# EAGLE design TessCam (EAGLE 5.06)
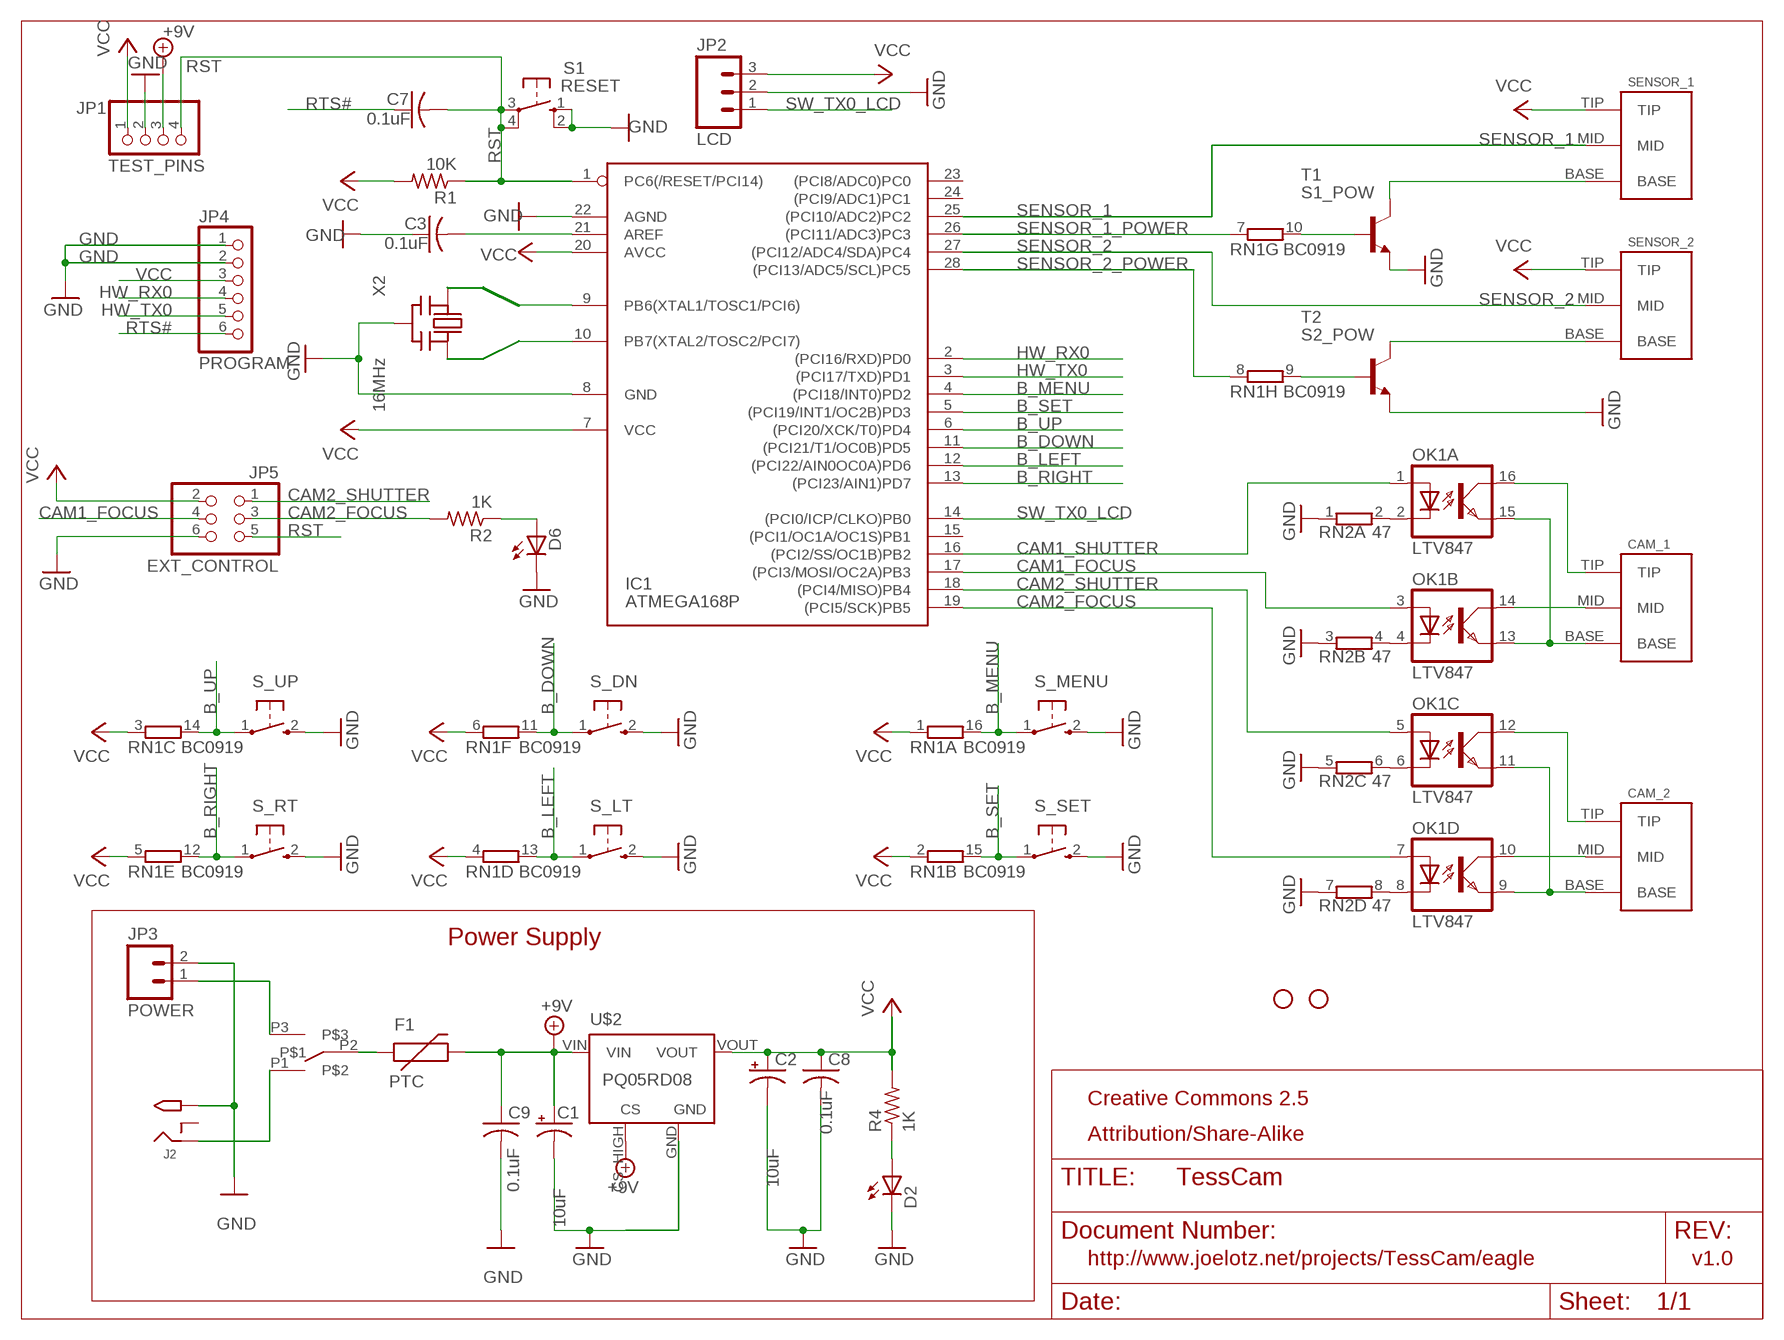
[diagram p0: schematic, sheet 1]

## Parts
C1  10uF  CPOL-USE2.5-6  [E2,5-6]
C2  10uF  CPOL-USE2.5-6  [E2,5-6]
C3  0.1uF  C-US025-025X050  [C025-025X050]
C7  0.1uF  C-US025-025X050  [C025-025X050]
C8  0.1uF  C-US025-025X050  [C025-025X050]
C9  0.1uF  C-US025-025X050  [C025-025X050]
CAM_1  3.5MM_JACK_ASJ-1-3STANDARD  [3.5MM_JACK_ASJ-1-3]
CAM_2  3.5MM_JACK_ASJ-1-3STANDARD  [3.5MM_JACK_ASJ-1-3]
D2  LTL-1CHG  LED3MM  [LED3MM]
D6  LTL-1CHE  LED3MM  [LED3MM]
F1  PTC  PTCPTH  [PTC]
IC1  ATMEGA168P  ATMEGA168PROUND  [DIL28/3]
J2  2.1MMJACK  [PJ-102A]
JP1  TEST_PINS  PINHD-1X4CB  [1X04-CB]
JP2  LCD  M03SCREW_LOCK  [SCREWTERMINAL-3.5MM-3_LOCK.007S]
JP3  POWER  M023.5MM_LOCK  [SCREWTERMINAL-3.5MM-2_LOCK]
JP4  PROGRAM  PINHD-1X6CLEAN  [1X06-CLEAN]
JP5  EXT_CONTROL  PINHD-2X3  [2X03]
OK1  LTV847  PC847  [DIL16]
R1  10K  R-US_0207/10  [0207/10]
R2  1K  R-US_0207/10  [0207/10]
R4  1K  R-US_0207/10  [0207/10]
RN1  BC0919  8R-N  [DIL16]
RN2  47  E4R  [SIL8]
S1  RESET  10-XX  [B3F-10XX]
S_DN  SWITCH_PUSH  [PUSH_SWITCH]
S_LT  SWITCH_PUSH  [PUSH_SWITCH]
S_MENU  SWITCH_PUSH  [PUSH_SWITCH]
S_RT  SWITCH_PUSH  [PUSH_SWITCH]
S_SET  SWITCH_PUSH  [PUSH_SWITCH]
S_UP  SWITCH_PUSH  [PUSH_SWITCH]
SENSOR_1  3.5MM_JACK_ASJ-1-3STANDARD  [3.5MM_JACK_ASJ-1-3]
SENSOR_2  3.5MM_JACK_ASJ-1-3STANDARD  [3.5MM_JACK_ASJ-1-3]
T1  S1_POW  BC338-25-NPN-TO92-EBC  [TO92-EBC]
T2  S2_POW  BC338-25-NPN-TO92-EBC  [TO92-EBC]
U$1  P040020B  [P040020B]
U$2  PQ05RD08  [TO220-4]
U$7  STAND-OFF  [STAND-OFF]
U$8  STAND-OFF  [STAND-OFF]
X2  16MHz  CERMOSCILL  [CERM_OSC]

## Nets
+9V: C1.+ C9.1 F1.P$2 JP1.3 U$2.CS_HIGH(CS) U$2.VIN
B_DOWN: IC1.11((PCI21/T1/OC0B)PD5) RN1.11 S_DN.1(P)
B_LEFT: IC1.12((PCI22/AIN0OC0A)PD6) RN1.13 S_LT.1(P)
B_MENU: IC1.4((PCI18/INT0)PD2) RN1.16 S_MENU.1(P)
B_RIGHT: IC1.13((PCI23/AIN1)PD7) RN1.12 S_RT.1(P)
B_SET: IC1.5((PCI19/INT1/OC2B)PD3) RN1.15 S_SET.1(P)
B_UP: IC1.6((PCI20/XCK/T0)PD4) RN1.14 S_UP.1(P)
CAM1_FOCUS: IC1.17((PCI3/MOSI/OC2A)PB3) JP5.4 OK1.3(B:A)
CAM1_SHUTTER: IC1.16((PCI2/SS/OC1B)PB2) OK1.1(A:A)
CAM2_FOCUS: IC1.19((PCI5/SCK)PB5) JP5.3 OK1.7(D:A) R2.2
CAM2_SHUTTER: IC1.18((PCI4/MISO)PB4) JP5.1 OK1.5(C:A)
GND: C1.- C2.- C3.1 C8.2 C9.2 D2.K(C) D6.K(C) IC1.8(GND) IC1.22(AGND) J2.TIP JP1.2 JP2.2 JP3.2 JP4.1 JP4.2 JP5.6 RN2.1 RN2.3 RN2.5 RN2.7 S1.1(S) S1.2(S1) S_DN.2(S) S_LT.2(S) S_MENU.2(S) S_RT.2(S) S_SET.2(S) S_UP.2(S) T1.E T2.E U$2.GND X2.P$2(GND)
HW_RX0: IC1.2((PCI16/RXD)PD0) JP4.4
HW_TX0: IC1.3((PCI17/TXD)PD1) JP4.5
N$1: IC1.9(PB6(XTAL1/TOSC1/PCI6)) X2.P$1(IN)
N$2: IC1.10(PB7(XTAL2/TOSC2/PCI7)) X2.P$3(OUT)
N$3: C3.2 IC1.21(AREF)
N$4: RN1.10 T1.B
N$5: F1.P$1 U$1.P2
N$6: OK1.2(A:C) RN2.2
N$7: CAM_2.MID OK1.10(D:COL)
N$8: OK1.4(B:C) RN2.4
N$9: CAM_1.TIP OK1.16(A:COL)
N$10: RN1.9 T2.B
N$11: SENSOR_1.BASE T1.C
N$12: OK1.6(C:C) RN2.6
N$13: OK1.8(D:C) RN2.8
N$15: CAM_2.TIP OK1.12(C:COL)
N$16: CAM_2.BASE OK1.9(D:EMIT) OK1.11(C:EMIT)
N$17: CAM_1.MID OK1.14(B:COL)
N$18: CAM_1.BASE OK1.13(B:EMIT) OK1.15(A:EMIT)
N$19: JP3.1 U$1.P3
N$23: J2.RING U$1.P1
N$26: D2.A R4.1
N$27: D6.A R2.1
N$28: SENSOR_2.BASE T2.C
RST: C7.2 IC1.1(PC6(/RESET/PCI14)) JP1.4 JP5.5 R1.1 S1.3(P) S1.4(P1)
RTS#: C7.1 JP4.6
SENSOR_1: IC1.25((PCI10/ADC2)PC2) SENSOR_1.MID
SENSOR_1_POWER: IC1.26((PCI11/ADC3)PC3) RN1.7
SENSOR_2: IC1.27((PCI12/ADC4/SDA)PC4) SENSOR_2.MID
SENSOR_2_POWER: IC1.28((PCI13/ADC5/SCL)PC5) RN1.8
SW_TX0_LCD: IC1.14((PCI0/ICP/CLKO)PB0) JP2.1
VCC: C2.+ C8.1 IC1.7(VCC) IC1.20(AVCC) JP1.1 JP2.3 JP4.3 JP5.2 R1.2 R4.2 RN1.1 RN1.2 RN1.3 RN1.4 RN1.5 RN1.6 SENSOR_1.TIP SENSOR_2.TIP U$2.VOUT
Unconnected: IC1.15((PCI1/OC1A/OC1S)PB1) IC1.23((PCI8/ADC0)PC0) IC1.24((PCI9/ADC1)PC1) J2.RING_SW

## Notes on the sheet
- Power Supply
- Creative Commons 2.5
- Attribution/Share-Alike
- http://www.joelotz.net/projects/TessCam/eagle | v1.0

## Library data of the parts
C1 C2 = minimidi:CPOL-US: POLARIZED CAPACITOR, American symbol
C3 C7-C9 = minimidi:C-US: CAPACITOR, American symbol
CAM_1 CAM_2 SENSOR_1 SENSOR_2 = HobbyRobotics:3.5MM_JACK_ASJ-1-3
D2 D6 = minimidi:LED: LED OSRAM: - CHIPLED LG R971, LG N971, LY N971, LG Q971, LY Q971, LO R971, LY R971 LH N974, LH R974 LS Q976, LO Q976, LY Q976 LO Q996 - Hyper CHIPLED LW Q18S LB Q993, LB Q99A, LB R99A - SideLED LS A670, LO A670, LY A670, LG A670, LP A670 LB A673, LV A673, LT A673, LW A673 LH A674 LY A675 LS A676, LA A676, LO A676, LY A676, LW A676 LS A679, LY A679, LG A679 - Hyper Micro SIDELED® LS Y876, LA Y876, LO Y876, LY Y876 LT Y87S - SmartLED LW L88C, LW L88S LB L89C, LB L89S, LG L890 LS L89K, LO L89K, LY L89K LS L896, LA L896, LO L896, LY L896 - TOPLED LS T670, LO T670, LY T670, LG T670, LP T670 LSG T670, LSP T670, LSY T670, LOP T670, LYG T670 LG T671, LOG T671, LSG T671 LB T673, LV T673, LT T673, LW T673 LH T674 LS T676, LA T676, LO T676, LY T676, LB T676, LH T676, LSB T676, LW T676 LB T67C, LV T67C, LT T67C, LS T67K, LO T67K, LY T67K, LW E67C LS E67B, LA E67B, LO E67B, LY E67B, LB E67C, LV E67C, LT E67C LW T67C LS T679, LY T679, LG T679 LS T770, LO T770, LY T770, LG T770, LP T770 LB T773, LV T773, LT T773, LW T773 LH T774 LS E675, LA E675, LY E675, LS T675 LS T776, LA T776, LO T776, LY T776, LB T776 LHGB T686 LT T68C, LB T68C - Hyper Mini TOPLED® LB M676 - Mini TOPLED Santana® LG M470 LS M47K, LO M47K, LY M47K Source: http://www.osram.convergy.de/
F1 = SparkFun:PTC: Resettable Fuse PTC Resettable Fuse. Spark Fun Electronics SKU : COM-08357
IC1 = avr:ATMEGA168*P: MICROCONTROLLER 16 kBytes FLASH 1 kBytes SRAM 512 Bytes EEPROM USART 8-channel 10 bit ADC
J2 = minimidi:2.1MMJACK
JP1 = carduino:PINHD-1X4: PIN HEADER
JP2 = HobbyRobotics:M03: Header 3 Standard 3-pin 0.1" header. Use with straight break away headers (SKU : PRT-00116), right angle break away headers (PRT-00553), swiss pins (PRT-00743), machine pins (PRT-00117), and female headers (PRT-00115). Molex polarized connector foot print use with SKU : PRT-08232 with associated crimp pins and housings.
JP3 = SparkFun:M02: Header 2 Standard 2-pin 0.1" header. Use with straight break away headers (SKU : PRT-00116), right angle break away headers (PRT-00553), swiss pins (PRT-00743), machine pins (PRT-00117), and female headers (PRT-00115). Molex polarized connector foot print use with SKU : PRT-08233 with associated crimp pins and housings.
JP4 = carduino:PINHD-1X6: PIN HEADER
JP5 = pinhead-ez:PINHD-2X3: PIN HEADER
OK1 = optocoupler:PC847: SHARP OPTO COUPLER
R1 R2 R4 = rcl:R-US_: RESISTOR, American symbol
RN1 = resistor-dil:8R-N: DIL RESISTOR
RN2 = resistor-sil:E4R: SIL RESISTOR
S1 = switch-omron:10-XX: OMRON SWITCH
S_DN S_LT S_MENU S_RT S_SET S_UP = HobbyRobotics:SWITCH_PUSH
T1 T2 = transistor:*-NPN-: NPN Transistror BF959 corrected 2008.03.06
U$1 = my-library:P040020B
U$2 = my-library:PQ05RD08
U$7 U$8 = HobbyRobotics:STAND-OFF: Stand Off This is the mechanical footprint for a #4 phillips button head screw. Use the keepout ring to avoid running the screw head into surrounding components. SKU : PRT-00447
X2 = digg:CERMOSCILL

## Board
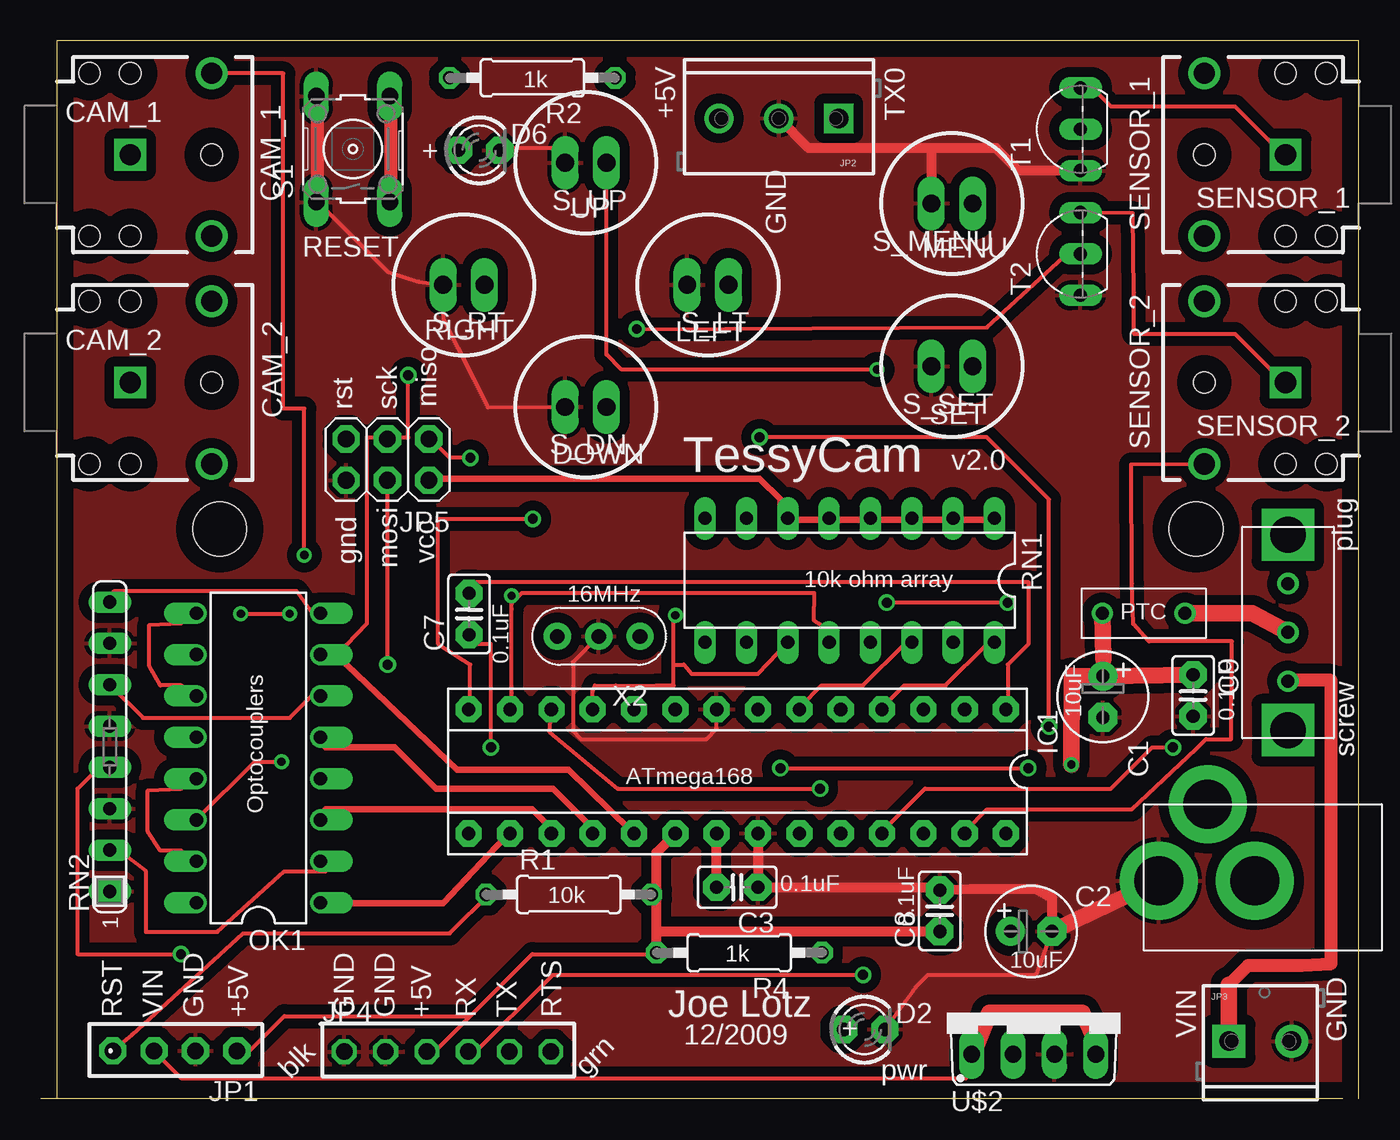
[diagram p1: board, top side]
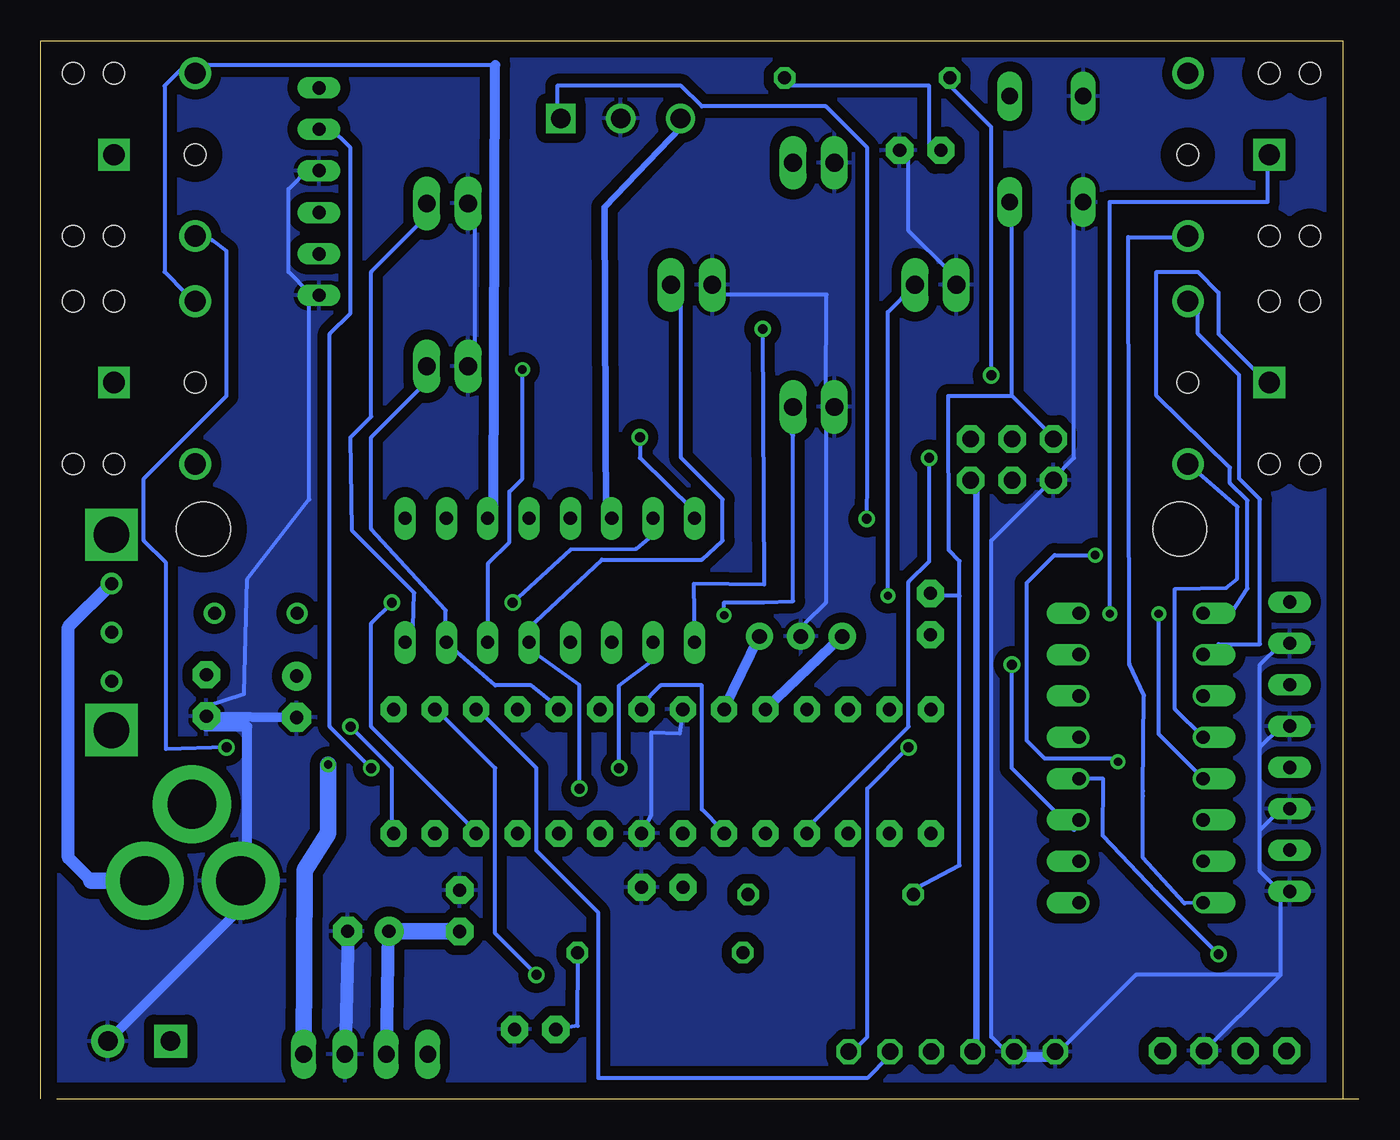
[diagram p2: board, bottom side, seen from below]

Size 81 x 65 mm. Coordinates in mm from the lower left corner, seen from the top.
Outline: 81,0 81,65 1,65 1,0
Outline: 80,0 0,0
Copper layers (1*16): Top 0.035mm / dielectric 1.5mm / Bottom 0.035mm
Design rules "default": minimum track width 10mil, minimum drill 24mil, track to track 8mil, track to pad 8mil, pad to pad 8mil, via to via 8mil, smd to smd 8mil, copper to edge 40mil, drill to drill 8mil, minimum pad ring 10mil, minimum via ring 8mil, stop-mask expansion 4mil, vias tented up to drill 0mil, thermal gap 10mil

### Footprints (pad centres in the part's own frame; a part is rotated, then mirrored left to right if it is on the bottom)
E2,5-6 = drill 0.813 pad 1.778 round: + -1.27,0 | drill 0.813 pad 1.778 octagon: - 1.27,0
C025-025X050 = drill 0.813 pad 1.676 octagon: 1 -1.27,0; 2 1.27,0
3.5MM_JACK_ASJ-1-3 = drill 1.3 square: BASE -0.5,0 | drill 1.3 round: MID 4.5,5; TIP 4.5,-5 | hole 1.3: -3,5; -0.5,5; -0.5,-5; -3,-5; 4.5,0
LED3MM = drill 0.813 pad 1.676 octagon: A -1.27,0; K 1.27,0
PTC = drill 0.8 round: P$1 -2.54,0; P$2 2.54,0
DIL28/3 = drill 0.813 pad 1.6 octagon: 1 -16.51,-3.81; 2 -13.97,-3.81; 3 -11.43,-3.81; 4 -8.89,-3.81; 5 -6.35,-3.81; 6 -3.81,-3.81; 7 -1.27,-3.81; 8 1.27,-3.81; 9 3.81,-3.81; 10 6.35,-3.81; 11 8.89,-3.81; 12 11.43,-3.81; 13 13.97,-3.81; 14 16.51,-3.81; 15 16.51,3.81; 16 13.97,3.81; 17 11.43,3.81; 18 8.89,3.81; 19 6.35,3.81; 20 3.81,3.81; 21 1.27,3.81; 22 -1.27,3.81; 23 -3.81,3.81; 24 -6.35,3.81; 25 -8.89,3.81; 26 -11.43,3.81; 27 -13.97,3.81; 28 -16.51,3.81
PJ-102A = drill 3 pad 4.8 round: RING 0.1,-3.39; RING_SW -4.6,-6.29; TIP 0.1,-9.29
1X04-CB = drill 1.016 pad 1.676 octagon: 1 -3.81,0; 2 -1.27,0; 3 1.27,0; 4 3.81,0
SCREWTERMINAL-3.5MM-3_LOCK.007S = drill 1.2 square: 1 -0.178,0 | drill 1.2 round: 2 3.5,0; 3 7.178,0
SCREWTERMINAL-3.5MM-2_LOCK = drill 1.2 pad 2.032 square: 1 -0.178,0 | drill 1.2 pad 2.032 round: 2 3.678,0
1X06-CLEAN = drill 1.016 octagon: 1 -6.35,0; 2 -3.81,0; 3 -1.27,0; 4 1.27,0; 5 3.81,0; 6 6.35,0
2X03 = drill 1.016 pad 1.676 octagon: 1 -2.54,-1.27; 2 -2.54,1.27; 3 0,-1.27; 4 0,1.27; 5 2.54,-1.27; 6 2.54,1.27
DIL16 = drill 0.813 offset: 1 -8.89,-3.81; 2 -6.35,-3.81; 3 -3.81,-3.81; 4 -1.27,-3.81; 5 1.27,-3.81; 6 3.81,-3.81; 7 6.35,-3.81; 8 8.89,-3.81; 9 8.89,3.81; 10 6.35,3.81; 11 3.81,3.81; 12 1.27,3.81; 13 -1.27,3.81; 14 -3.81,3.81; 15 -6.35,3.81; 16 -8.89,3.81
0207/10 = drill 0.813 octagon: 1 -5.08,0; 2 5.08,0
DIL16' = drill 0.813 long: 1 -8.89,-3.81; 2 -6.35,-3.81; 3 -3.81,-3.81; 4 -1.27,-3.81; 5 1.27,-3.81; 6 3.81,-3.81; 7 6.35,-3.81; 8 8.89,-3.81; 9 8.89,3.81; 10 6.35,3.81; 11 3.81,3.81; 12 1.27,3.81; 13 -1.27,3.81; 14 -3.81,3.81; 15 -6.35,3.81; 16 -8.89,3.81
SIL8 = drill 0.813 long: 1 -8.89,0; 2 -6.35,0; 3 -3.81,0; 4 -1.27,0; 5 1.27,0; 6 3.81,0; 7 6.35,0; 8 8.89,0
B3F-10XX = drill 1.016 long: 1 -3.251,2.261; 2 3.251,2.261; 3 -3.251,-2.261; 4 3.251,-2.261
PUSH_SWITCH = drill 1.1 long: 1 0,-1.27; 2 0,1.27
TO92-EBC = drill 0.813 long: B 0,-1.27; C 2.54,-1.27; E -2.54,-1.27
P040020B = drill 2.2 square: NOCONNECT1 0.26,6.15; NOCONNECT2 0.26,-5.85 | drill 0.8 round: P1 0.26,3.15; P2 0.26,0.15; P3 0.26,-2.85
TO220-4 = drill 1.016 long: CS_HIGH 9.16,-2.54; GND 6.62,-2.54; VIN 1.54,-2.54; VOUT 4.08,-2.54
STAND-OFF = hole 3.302: 0,0
CERM_OSC = drill 0.9 pad 1.676 round: P$1 -2.54,0; P$2 0,0; P$3 2.54,0

### Placement (x,y rotation side)
C1  65.27,24.7 270 top
C2  60.87,10.29 0 top
C3  42.8,13 180 top
C7  26.32,29.78 90 top
C8  55.25,11.55 90 top
C9  70.82,24.78 270 top
CAM_1  6,58 0 top
CAM_2  6,44 0 top
D2  50.61,4.26 0 top
D6  26.95,58.27 0 top
F1  67.78,29.83 180 top
IC1  42.81,20.11 180 top
J2  78,13.5 270 top
JP1  8.24,2.95 180 top
JP2  48.86,60.23 180 top
JP3  73.2,3.54 0 top
JP4  25,2.9 0 top
JP5  21.31,39.27 180 top
OK1  13.38,20.94 90 top
R1  32.45,12.55 0 top
R2  30.21,62.72 180 top
R4  42.93,8.98 180 top
RN1  BC0919  [DIL16']  49.72,31.85 180 top
RN2  4.25,21.63 90 top
S1  19.19,58.34 90 top
S_DN  33.5,42.5 90 top
S_LT  41,50 90 top
S_MENU  56,55 90 top
S_RT  26,50 90 top
S_SET  56,45 90 top
S_UP  33.5,57.5 90 top
SENSOR_1  76,58 180 top
SENSOR_2  76,44 180 top
T1  62.62,59.56 90 top
T2  62.62,51.9 90 top
U$1  76.39,28.5 0 top
U$2  55.68,5.28 0 top
U$7  71,35 0 top
U$8  11,35 0 top
X2  34.29,28.41 180 top

### Tracks (layer width: path | path; a pad name or v marks a point on that pad's centre or on a via)
+9V  (via drill 0.51)
  Top 0.254: 64.77,2.64 U$2.CS_HIGH | JP1.3 7.35,2.54 8.62,1.27 56.88,1.27 57.25,2.64 U$2.VIN
  Top 0.61: C1.+ 65.3,27
  Top 0.813: 64.67,3.91 64.77,2.64
  Top 1.016: 57.25,2.64 58.29,5.28 64,5.28 64.67,3.91 | v63.34,20.53 63.37,26 C1.+ C9.1 | 65.3,27 F1.P$2
  Bottom 1.016: v63.34,20.53 63.34,16.31 64.77,14.04 64.77,13.94 U$2.CS_HIGH
B_DOWN  (via drill 0.51)
  Top 0.254: IC1.11 33.92,25.03 34.06,25.39 35.33,25.39 37.83,25.4 38.9,25.4 38.9,26.67 | RN1.11 44.07,26.1 40,26.1 39.53,26.67 38.9,26.67 | v39,29.7 38.9,29.6 38.9,26.67
  Bottom 0.254: S_DN.1 35.29,41.91 34.76,40.74 34.76,30.58 36.58,30.5 39,30.5 v39,29.7
B_LEFT  (via drill 0.61)
  Top 0.254: v47.89,19.05 35.46,19.05 31.28,22.53 IC1.12
  Bottom 0.254: 51.03,27.64 47.89,25.4 v47.89,19.05 | 51.03,27.64 51.03,28.91 46.52,33.12 40.37,33.12 39.1,34.29 39.1,36.83 41.64,39.37 41.64,49.53 S_LT.1 | 51.03,27.64 RN1.13
B_MENU
  Top 0.254: RN1.16 58.15,27.94 55.61,25.4 53.07,25.4 51.8,24.13 IC1.4
  Bottom 0.254: S_MENU.1 56.88,54.61 60.69,50.8 60.69,41.91 61.96,40.64 61.86,34.89 58.05,31.08 58.15,27.94 RN1.16
B_RIGHT  (via drill 0.51)
  Top 0.254: 28.94,30.1 28.94,24.93 IC1.13 | 28.94,30.1 28.94,30.44 29.58,31.08 47.52,31.08 47.49,29.41 48.39,28.84 RN1.12 | 28.94,30.1 v28.94,30.9
  Bottom 0.254: S_RT.1 28.94,48.33 v28.94,30.9
B_SET
  Bottom 0.254: 56.11,28.04 53.07,25.4 50.86,25.4 49.26,24.13 IC1.5 | 56.11,28.04 56.11,30.01 60.69,34.99 60.69,40.64 56.88,44.45 S_SET.1 | 56.11,28.04 RN1.15
B_UP  (via drill 0.51)
  Top 0.254: RN1.14 53.07,27.94 50.53,25.4 47.99,25.4 46.72,24.13 IC1.6 | S_UP.1 34.77,45.73 35.7,44.8 v51.4,44.8
  Bottom 0.254: v51.4,44.8 51.4,38.1 52.2,37.3 52.2,34.2 53.5,32.9 53.5,28.07 RN1.14
CAM1_FOCUS  (via drill 0.61)
  Top 0.254: 31.48,16.51 IC1.17 | v21.32,26.67 21.32,38.1 JP5.4
  Top 0.305: OK1.3 17.51,17.78
  Top 0.406: 17.51,17.78 30.21,17.78 31.48,16.51
  Bottom 0.254: v21.32,26.67 21.32,20.32 17.51,16.51 OK1.3
CAM1_SHUTTER
  Top 0.254: OK1.1 17.11,12 | 28.94,16.51 IC1.16
  Top 0.406: 17.11,12 24.73,12 28.94,16.51
CAM2_FOCUS  (via drill 0.61)
  Top 0.254: 18.18,27.24 17.61,27.54 OK1.7 18.18,27.24 | 18.18,27.24 20.05,29.21 20.05,40.64 21.32,40.64 | v22.59,44.45 22.59,40.64 21.32,40.64 | 21.32,40.64 JP5.3 | 36.26,16.51 IC1.19
  Top 0.406: 36.26,16.51 32.45,20.22 25.6,20.22 18.18,27.24
  Bottom 0.254: v22.59,44.45 22.59,59.69 25.13,62.23 R2.2
CAM2_SHUTTER  (via drill 0.61)
  Top 0.254: OK1.5 17.51,21.59 | 34.02,16.51 IC1.18 | v26.4,39.37 25.13,39.37 23.86,40.64 JP5.1
  Top 0.406: 17.51,21.59 21.76,21.59 24.3,19.05 31.48,19.05 34.02,16.51
  Bottom 0.254: v26.4,39.37 26.4,33.02 27.67,31.75 27.67,22.86 34.02,16.51 IC1.18
GND
  Top 0.254: 17.01,55.98 S1.1 17.51,54.61 21.32,50.8 23.23,50.2 S_RT.2 24.73,47.93 27.48,42.48 S_DN.2 | 17.01,61.06 S1.2 | S_UP.2 31.48,58.42 28.94,58.42 D6.K | X2.P$2 32.7,26.82 32.7,22.6 33.2,22.1 40.9,22.1 41.54,22.74 IC1.8 | D2.K 53.78,6.88 54.5,7.6 61.15,7.6 C2.-
  Top 0.61: C2.- 62.14,12.36 61.2,12.9 57.13,12.9 C8.2 55.07,13 C3.1 IC1.22 | T1.E 60.08,57.02 58.7,58.4 54.7,58.4 | 54.7,58.4 47.19,58.4 JP2.2 | S_MENU.2 54.73,58.37 54.7,58.4
  Top 0.813: 17.01,55.98 17.01,61.06
  Top 1.016: C2.- J2.TIP
  Bottom 0.254: IC1.8 41.74,22.43 43.48,22.49 43.48,17.41 IC1.22 | 4.81,12.7 6.08,13.97 6.08,16.51 | 6.08,16.51 4.81,17.78 RN2.3 | 6.08,21.59 4.81,22.86 RN2.5 | 6.08,16.51 6.08,21.59 | 6.08,21.59 6.08,26.67 4.81,27.94 RN2.7 | 4.81,7.62 9.89,2.54 JP1.2 | 4.81,7.62 4.81,12.7 | 4.81,12.7 RN2.1 | 4.81,7.62 13.7,7.62 18.78,2.54 JP4.1 | 64.5,49.53 65.77,50.8 65.77,55.88 64.5,57.15 T1.E | S_SET.2 54.34,45.72 54.34,54.61 S_MENU.2 | 18.78,38.1 17.51,39.37 17.51,54.61 S1.1 | S_RT.2 25.13,50.8 27.67,53.34 27.67,58.42 D6.K | S_LT.2 39.1,49.53 38.97,49.4 32.7,49.4 32.75,43.18 S_DN.2 32.75,41.91 32.75,30.48 34.02,29.21 X2.P$2 | 18.78,38.1 22.59,34.29 22.59,3.81 21.32,2.54 JP4.2 | 18.78,38.1 JP5.6 | 64.5,49.53 64.5,36.83 68.31,31.92 68.51,24.87 70.85,24.13 C9.2 | 64.5,49.53 T2.E
  Bottom 0.61: C1.- C9.2 70.85,22.86 68.31,22.86 68.31,13.97 J2.TIP 68.71,11.71 JP3.2 | C2.- 62.1,10.25 | 18.78,2.54 20.83,2.54 JP4.2
  Bottom 0.813: 62.1,10.25 U$2.GND
  pour Top (isolate 0.61): 0.25,66.3 0.25,-2.7 88.02,-2.9 88.02,66 0.3,66.8
  pour Bottom (isolate 0.61): 95.1,65.8 95.1,-5.07 -1.66,-3.47 -1.66,66.3 -2,67.4
HW_RX0  (via drill 0.61)
  Top 0.254: v50.53,7.62 31.48,7.62 26.4,2.54 JP4.4
  Bottom 0.254: v50.53,7.62 53.07,10.16 53.07,20.32 56.88,24.13 IC1.2
HW_TX0
  Bottom 0.254: JP4.5 28.94,2.54 30.21,1.27 46.72,1.27 46.72,11.43 50.53,15.24 50.53,20.32 54.34,24.13 IC1.3
N$1
  Bottom 0.61: IC1.9 X2.P$1
N$2
  Bottom 0.61: IC1.10 X2.P$3
N$3
  Top 0.61: C3.2 IC1.21
N$4  (via drill 0.61)
  Top 0.254: v45.45,20.32 v60.69,20.32
  Bottom 0.254: v45.45,20.32 45.45,25.4 43.41,26.94 RN1.10 | v60.69,20.32 63.23,22.86 63.23,46.99 61.96,48.26 61.96,58.42 63.23,59.69 T1.B
N$5
  Top 1.016: F1.P$1 74.47,29.83 U$1.P2
N$6
  Top 0.254: RN2.2 4.81,15.24 6.48,13.97 6.48,10.26 10.86,10.26 14.97,13.97 17.51,13.97 OK1.2
N$7
  Bottom 0.254: OK1.10 8.62,27.94 6.08,27.94 6.08,36.83 7.35,38.1 7.35,44.45 9.89,46.99 9.89,48.26 CAM_2.MID
N$8  (via drill 0.61)
  Top 0.254: v8.62,8.89 2.27,8.89 2.27,19.05 3.54,20.32 RN2.4
  Bottom 0.254: v8.62,8.89 12.43,12.7 15.73,16.17 15.71,19.65 OK1.4
N$9
  Bottom 0.254: OK1.16 10.72,12 13.26,14.8 13.26,18.61 13.27,18.92 13.2,24.79 14.1,26.7 14.17,52.94 11.26,52.94 CAM_1.TIP
N$10  (via drill 0.61)
  Top 0.254: v36.63,47.29 58.15,47.39 63.23,52.07 T2.B
  Bottom 0.254: v36.63,47.29 36.53,31.58 40.87,31.64 RN1.9
N$11
  Top 0.254: T1.C 64.5,62.23 65.77,60.96 73.39,60.96 75.93,58.42 SENSOR_1.BASE
N$12
  Top 0.254: RN2.6 6.29,23.4 15.3,23.4 16.65,24.75 OK1.6
N$13
  Top 0.254: RN2.8 4.53,31.2 15.7,31.2 16.67,29.83 OK1.8
N$15
  Bottom 0.254: CAM_2.TIP 7.46,36.37 7.47,31.96 8.17,31.39 11.3,31.32 11.3,23.94 OK1.12
N$16
  Top 0.254: OK1.11 8.62,25.4 7.35,25.4 6.68,26.57 6.68,29.11 8.62,29.21 OK1.9
  Bottom 0.254: CAM_2.BASE 6.08,44.45 8.62,46.99 8.62,49.53 9.89,50.8 12.43,50.8 12.43,43.18 7.92,38.77 7.92,37.83 6.85,36.76 6.85,31.35 7.82,29.88 OK1.9
N$17  (via drill 0.51)
  Top 0.254: CAM_1.MID 14.9,63 14.9,42.4 16.2,42.4 v16.2,33.4 | v14.8,20.7 13.14,20.7 OK1.14
  Bottom 0.254: v16.2,33.4 18.7,33.4 20.4,31.7 20.4,22 19.3,20.9 15,20.9 v14.8,20.7
N$18  (via drill 0.51)
  Top 0.254: OK1.15 8.62,15.24 7.35,15.24 6.58,16.41 6.58,18.95 8.62,19.05 OK1.13 | v12.3,29.8 v15.3,29.8
  Bottom 0.254: OK1.13 12.3,22.4 v12.3,29.8 | v15.3,29.8 15.3,55.1 5.6,55.1 5.6,58 CAM_1.BASE
N$19
  Top 0.61: 76.7,25.7 U$1.P3
  Top 0.813: 73.02,7.02 74.2,8.2 77.5,8.2 79.3,8.3 79.3,25.7 76.7,25.7
  Top 1.016: JP3.1 73.02,7.02
N$23
  Bottom 0.813: U$1.P1 79.3,29 79.3,14.8 77.9,13.4
  Bottom 1.016: J2.RING 77.9,13.4
N$26
  Bottom 0.254: R4.1 47.99,8.89 48,4.48 D2.A
N$27
  Bottom 0.254: R2.1 35.29,62.23 26.4,62.23 26.4,58.42 D6.A
N$28
  Top 0.254: T2.C 67.1,54.41 67.18,49.53 67.18,46.99 73.39,46.99 75.93,44.45 SENSOR_2.BASE
RST
  Top 0.254: S1.3 21.52,55.98 | 21.52,61.06 S1.4 | IC1.1 59.42,24.13 59.42,26.67 60.69,27.94 60.69,31.75 26.4,31.75 C7.2 | JP1.4 5.61,3.94 12.43,10.16 25.13,10.16 27.67,12.7 R1.1
  Top 0.813: 21.52,55.98 21.52,61.06
  Bottom 0.254: 21.32,43.18 18.78,40.64 JP5.5 | 21.32,43.18 21.32,54.61 S1.3 | 24.53,30.9 24.53,14.34 27.67,12.7 R1.1 | 21.32,43.18 25.23,43.18 25.2,33.7 24.53,33.03 24.53,30.9 | C7.2 26.32,30.9 24.53,30.9
RTS#  (via drill 0.61)
  Top 0.254: v27.67,21.59 27.67,27.94 26.4,27.94 C7.1
  Bottom 0.254: v27.67,21.59 30.21,19.05 30.21,3.81 31.48,2.54 JP4.6
SENSOR_1  (via drill 0.61)
  Top 0.254: v69.58,21.59 68.31,21.59 65.77,19.05 54.34,19.05 51.8,16.51 IC1.25
  Bottom 0.254: v69.58,21.59 73.29,21.49 73.29,32.92 74.66,34.29 74.66,38.1 69.58,43.18 69.58,52.07 70.45,52.74 SENSOR_1.MID
SENSOR_1_POWER  (via drill 0.61)
  Top 0.254: v59.42,30.48 v51.99,30.48
  Bottom 0.254: v51.99,30.48 48.41,33.76 44.4,33.8 43.4,34.63 RN1.7 | v59.42,30.48 60.69,29.21 60.69,22.86 54.34,16.51 IC1.26
SENSOR_2
  Top 0.254: IC1.27 56.88,16.51 58.15,17.78 67.04,17.78 71,21.5 71.6,22.1 73.16,22.1 73.2,28.1 68.1,28.1 67.13,29.17 67.06,31.67 67.02,38.97 SENSOR_2.MID
SENSOR_2_POWER  (via drill 0.61)
  Top 0.254: v44.18,40.64 58.15,40.64 61.96,36.83 v61.96,22.86
  Bottom 0.254: v44.18,40.64 44.18,39.37 40.87,36.16 RN1.8 | v61.96,22.86 59.42,20.32 59.42,16.51 IC1.28
SW_TX0_LCD  (via drill 0.61)
  Top 0.254: v30.24,35.63 24.43,35.63 24.43,27.94 26.4,26.67 26.4,24.13 IC1.14
  Bottom 0.254: v30.24,35.63 30.21,38.1 30.21,58.42 32.75,60.96 40.37,60.96 41.64,62.23 49.26,62.23 49.26,60.96 JP2.1
VCC
  Top 0.254: 47.99,35.56 RN1.5 | 50.53,35.56 RN1.4 | 53.07,35.56 RN1.3 | 58.15,35.56 RN1.1 | 55.61,35.56 RN1.2 | 37.83,12.7 R1.2 | 26.4,5.08 30.21,8.89 37.83,8.89 R4.2 | 26.4,5.08 23.86,2.54 JP4.3 | 26.4,5.08 14.97,5.08 12.43,2.54 JP1.1 | 45.45,35.56 RN1.6 | JP5.2 23.86,38.1
  Top 0.406: 58.15,35.56 55.61,35.56 53.07,35.56 50.53,35.56 47.99,35.56 45.45,35.56 45.45,36.83 44.18,38.1 23.86,38.1
  Top 0.61: 37.83,8.89 37.83,10.4 | 37.83,10.4 37.83,12.7 37.83,15.13 IC1.20 | C8.1 37.95,10.28 37.83,10.4
  Bottom 0.254: SENSOR_2.TIP 72.12,49.53 73.39,50.8 73.39,62.23 72.12,63.5 SENSOR_1.TIP 70.85,63.5 53.07,63.5 | RN1.6 46.25,35.26 | R1.2 37.83,12.7 | IC1.7 44.18,24.13 42.91,25.4 40.37,25.4 40.37,17.78 39.1,16.51 IC1.20 | 23.86,38.1 JP5.2 | JP4.3 23.86,2.54
  Bottom 0.406: 46.25,35.26 46.35,54.78 41.64,59.69 JP2.3 | 23.86,2.54 23.5,2.9 23.5,37.74 23.86,38.1
  Bottom 0.61: 53.07,63.5 53.17,36.26 RN1.3 | C2.+ 59.66,10.35
  Bottom 0.813: 59.66,10.35 U$2.VOUT
  Bottom 1.016: C8.1 55.19,10.28 C2.+

### Text on the board
tPlace: 1k | +5V | TX0 | + | CAM_1 | UP | RESET | GND | SENSOR_1 | MENU | RIGHT | LEFT | miso | CAM_2 | rst | sck | TessyCam | SET | v2.0 | SENSOR_2 | DOWN | plug | mosi | gnd | vcc | 16MHz | 10k ohm array | PTC | 0.1uF | Optocouplers | screw | 10uF | 0.1uF | ATmega168 | 0.1uF | 10k | 0.1uF | 1k | 10uF | Joe Lotz | RST | VIN | GND | +5V | GND | GND | +5V | RX | TX | RTS | 12/2009 | + | VIN | GND | pwr | blk | grn